# EAGLE design Pinduinov3-Nano-WPC-TPL521-AR (EAGLE 7.7.0)
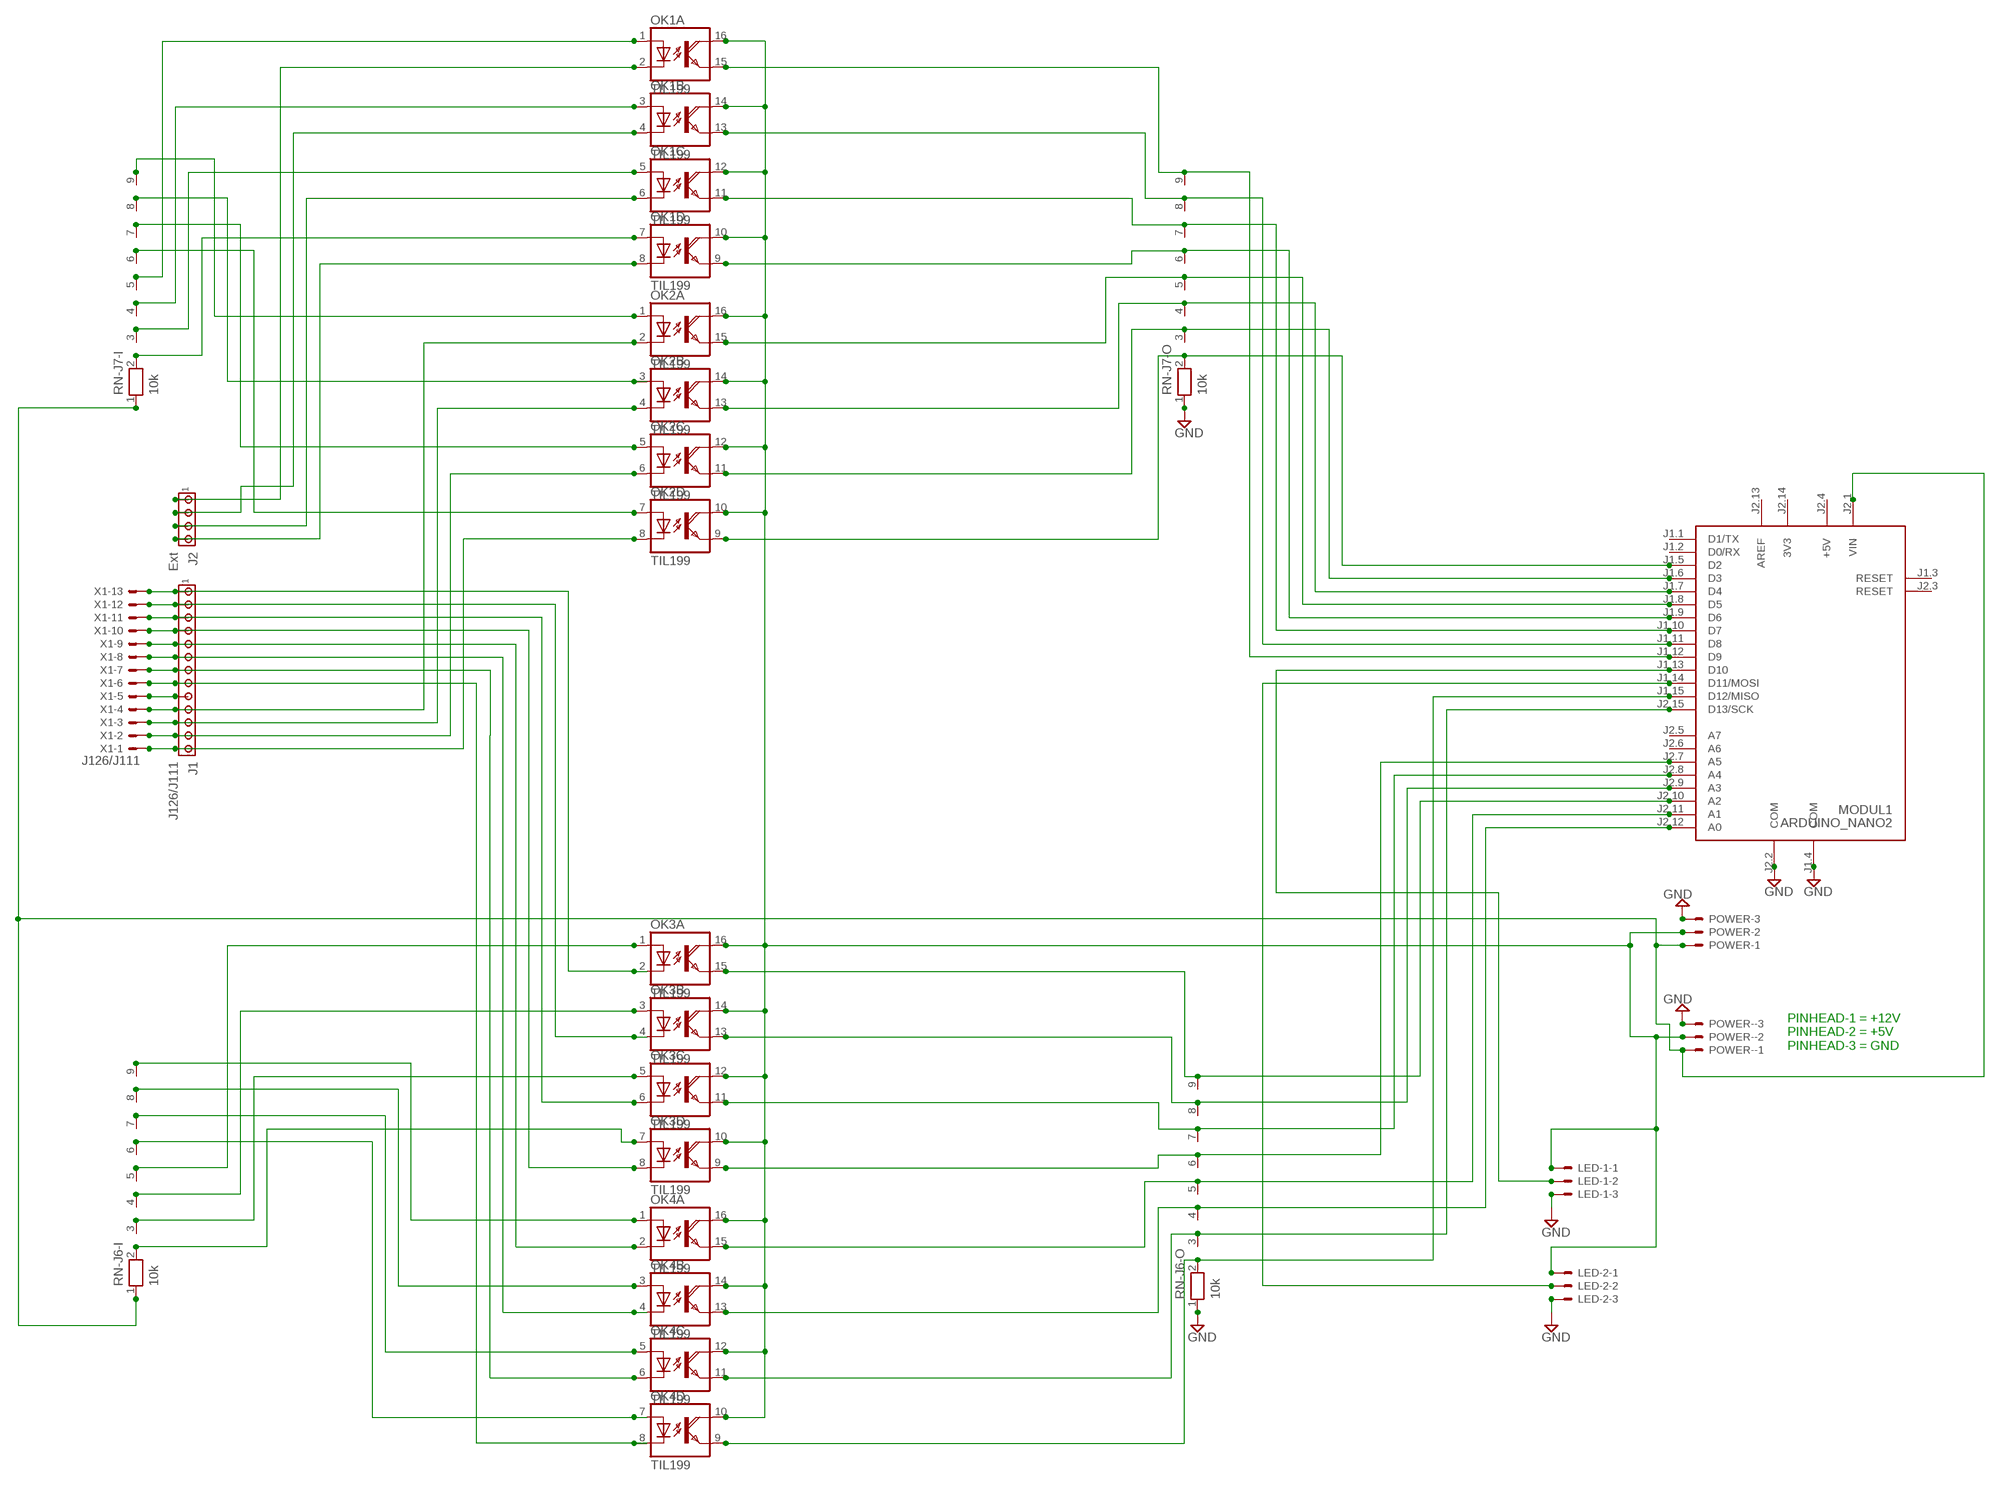
[diagram p0: schematic, sheet 1]

## Parts
J1  J126/J111  MTA13-156  [1X13MTA]
J2  Ext  MTA04-156  [1X4MTA]
LED-1  22-23-2031  [22-23-2031]
LED-2  22-23-2031  [22-23-2031]
MODUL1  ARDUINO_NANO2  [ARDUINO_NANO2]
OK1  TIL199  [DIL16]
OK2  TIL199  [DIL16]
OK3  TIL199  [DIL16]
OK4  TIL199  [DIL16]
POWER  22-23-2031  [22-23-2031]
POWER-  22-23-2031  [22-23-2031]
RN-J6-I  10k  RN08  [RN-9]
RN-J6-O  10k  RN08  [RN-9]
RN-J7-I  10k  RN08  [RN-9]
RN-J7-O  10k  RN08  [RN-9]
X1  J126/J111  KK-156-13  [KK-156-13]

## Nets
ARD+5V [Power]: LED-1.1 LED-2.1 OK1.10(D:COL) OK1.12(C:COL) OK1.14(B:COL) OK1.16(A:COL) OK2.10(D:COL) OK2.12(C:COL) OK2.14(B:COL) OK2.16(A:COL) OK3.10(D:COL) OK3.12(C:COL) OK3.14(B:COL) OK3.16(A:COL) OK4.10(D:COL) OK4.12(C:COL) OK4.14(B:COL) OK4.16(A:COL) POWER-.2 POWER.2
GND: LED-1.3 LED-2.3 MODUL1.J1.4(COM) MODUL1.J2.2(COM) POWER-.3 POWER.3 RN-J6-O.1 RN-J7-O.1
N$2: MODUL1.J1.5(D2) OK2.9(D:EMI) RN-J7-O.2
N$3: OK1.3(B:A) RN-J7-I.4
N$4: OK1.5(C:A) RN-J7-I.3
N$5: OK1.7(D:A) RN-J7-I.2
N$6: OK2.1(A:A) RN-J7-I.9
N$7: OK2.3(B:A) RN-J7-I.8
N$8: OK2.5(C:A) RN-J7-I.7
N$9: OK1.1(A:A) RN-J7-I.5
N$13: OK2.7(D:A) RN-J7-I.6
N$15: J2.1 OK1.2(A:C)
N$18: MODUL1.J1.6(D3) OK2.11(C:EMI) RN-J7-O.3
N$19: J1.11 OK2.4(B:C) X1.3
N$20: J1.12 OK2.6(C:C) X1.2
N$21: J1.2 OK3.4(B:C) X1.12
N$22: J1.1 OK3.2(A:C) X1.13
N$23: J1.10 OK2.2(A:C) X1.4
N$24: MODUL1.J1.11(D8) OK1.13(B:EMI) RN-J7-O.8
N$25: J1.13 OK2.8(D:C) X1.1
N$27: J1.5 OK4.2(A:C) X1.9
N$28: MODUL1.J1.7(D4) OK2.13(B:EMI) RN-J7-O.4
N$29: OK4.1(A:A) RN-J6-I.9
N$30: OK4.3(B:A) RN-J6-I.8
N$31: OK4.5(C:A) RN-J6-I.7
N$32: OK3.3(B:A) RN-J6-I.4
N$33: OK3.1(A:A) RN-J6-I.5
N$34: OK3.5(C:A) RN-J6-I.3
N$35: OK4.7(D:A) RN-J6-I.6
N$36: MODUL1.J2.8(A4) OK3.11(C:EMI) RN-J6-O.7
N$37: OK3.7(D:A) RN-J6-I.2
N$38: MODUL1.J2.7(A5) OK3.9(D:EMI) RN-J6-O.6
N$39: MODUL1.J2.15(D13/SCK) OK4.11(C:EMI) RN-J6-O.3
N$40: J2.2 OK1.4(B:C)
N$42: MODUL1.J2.12(A0) OK4.13(B:EMI) RN-J6-O.4
N$43: MODUL1.J2.11(A1) OK4.15(A:EMI) RN-J6-O.5
N$44: LED-2.2 MODUL1.J1.14(D11/MOSI)
N$45: LED-1.2 MODUL1.J1.13(D10)
N$46: MODUL1.J1.12(D9) OK1.15(A:EMI) RN-J7-O.9
N$47: J2.3 OK1.6(C:C)
N$48: J2.4 OK1.8(D:C)
N$49: MODUL1.J1.10(D7) OK1.11(C:EMI) RN-J7-O.7
N$51: MODUL1.J1.8(D5) OK2.15(A:EMI) RN-J7-O.5
N$54: MODUL1.J1.9(D6) OK1.9(D:EMI) RN-J7-O.6
N$55: MODUL1.J2.9(A3) OK3.13(B:EMI) RN-J6-O.8
N$56: MODUL1.J2.10(A2) OK3.15(A:EMI) RN-J6-O.9
N$58: J1.8 OK4.8(D:C) X1.6
N$59: J1.7 OK4.6(C:C) X1.7
N$60: MODUL1.J1.15(D12/MISO) OK4.9(D:EMI) RN-J6-O.2
N$61 [GND]: MODUL1.J2.1(VIN) POWER-.1 POWER.1 RN-J6-I.1 RN-J7-I.1
N$62: J1.6 OK4.4(B:C) X1.8
N$64: J1.9 X1.5
N$65: J1.4 OK3.8(D:C) X1.10
N$66: J1.3 OK3.6(C:C) X1.11
Unconnected: MODUL1.J1.1(D1/TX) MODUL1.J1.2(D0/RX) MODUL1.J1.3(RESET) MODUL1.J2.3(RESET) MODUL1.J2.5(A7) MODUL1.J2.6(A6)

## Notes on the sheet
- PINHEAD-1 = +12V
  PINHEAD-2 = +5V
  PINHEAD-3 = GND

## Power pins joined to a net without a drawn wire
3V3: MODUL1.J2.14(3V3)
+5V: MODUL1.J2.4(+5V)
AREF: MODUL1.J2.13(AREF)

## Library data of the parts
J1 = con-amp:MTA13-156: AMP connector
J2 = con-amp:MTA04-156: AMP connector
LED-1 LED-2 POWER POWER- = con-molex:22-23-2031: .100" (2.54mm) Center Header - 3 Pin; MF: MOLEX; MPN: 22-23-2031; OC_FARNELL: 1462950; OC_NEWARK: 30C0862
MODUL1 = arduino:ARDUINO_NANO2: Arduino Nano2 Auto generated by modulcreator.ulp \;; ANZAHL: 2; MODUL: TRUE; STECKX0: -76200; STECKX1: 76200; STECKY0: 177800; STECKY1: 177800
OK1-OK4 = optocoupler:TIL199: TEXAS INSTRUMENTS OPTO COUPLER; MPN: TIL 199; OC_FARNELL: 1683370; OC_NEWARK: 05R6483
RN-J6-I RN-J6-O RN-J7-I RN-J7-O = resistor-net:RN08: RESISTOR NETWORK; OC_FARNELL: unknown; OC_NEWARK: unknown
X1 = con-molex:KK-156-13: KK 156 HEADER Source: http://www.molex.com/pdm_docs/sd/026604100_sd.pdf; OC_FARNELL: unknown; OC_NEWARK: unknown

## Net classes
0 default: width 0.406 mm
1 Power: width 0.61 mm
2 GND: width 0.61 mm

## Board
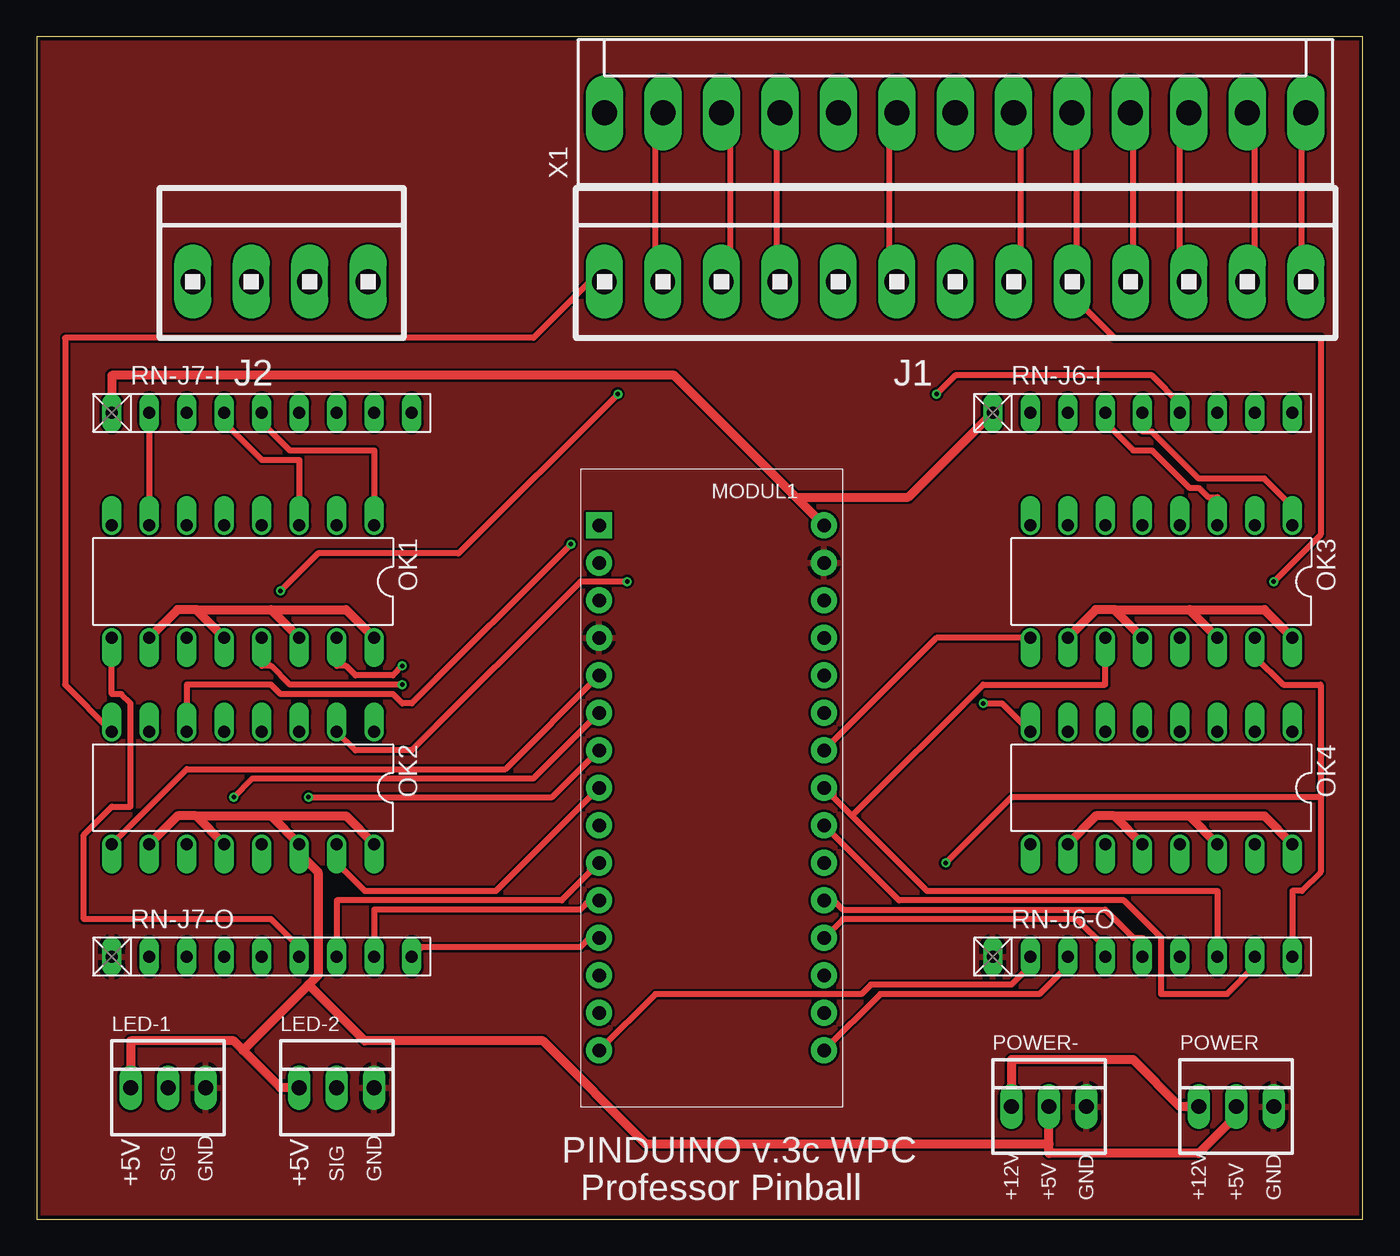
[diagram p1: board, top side]
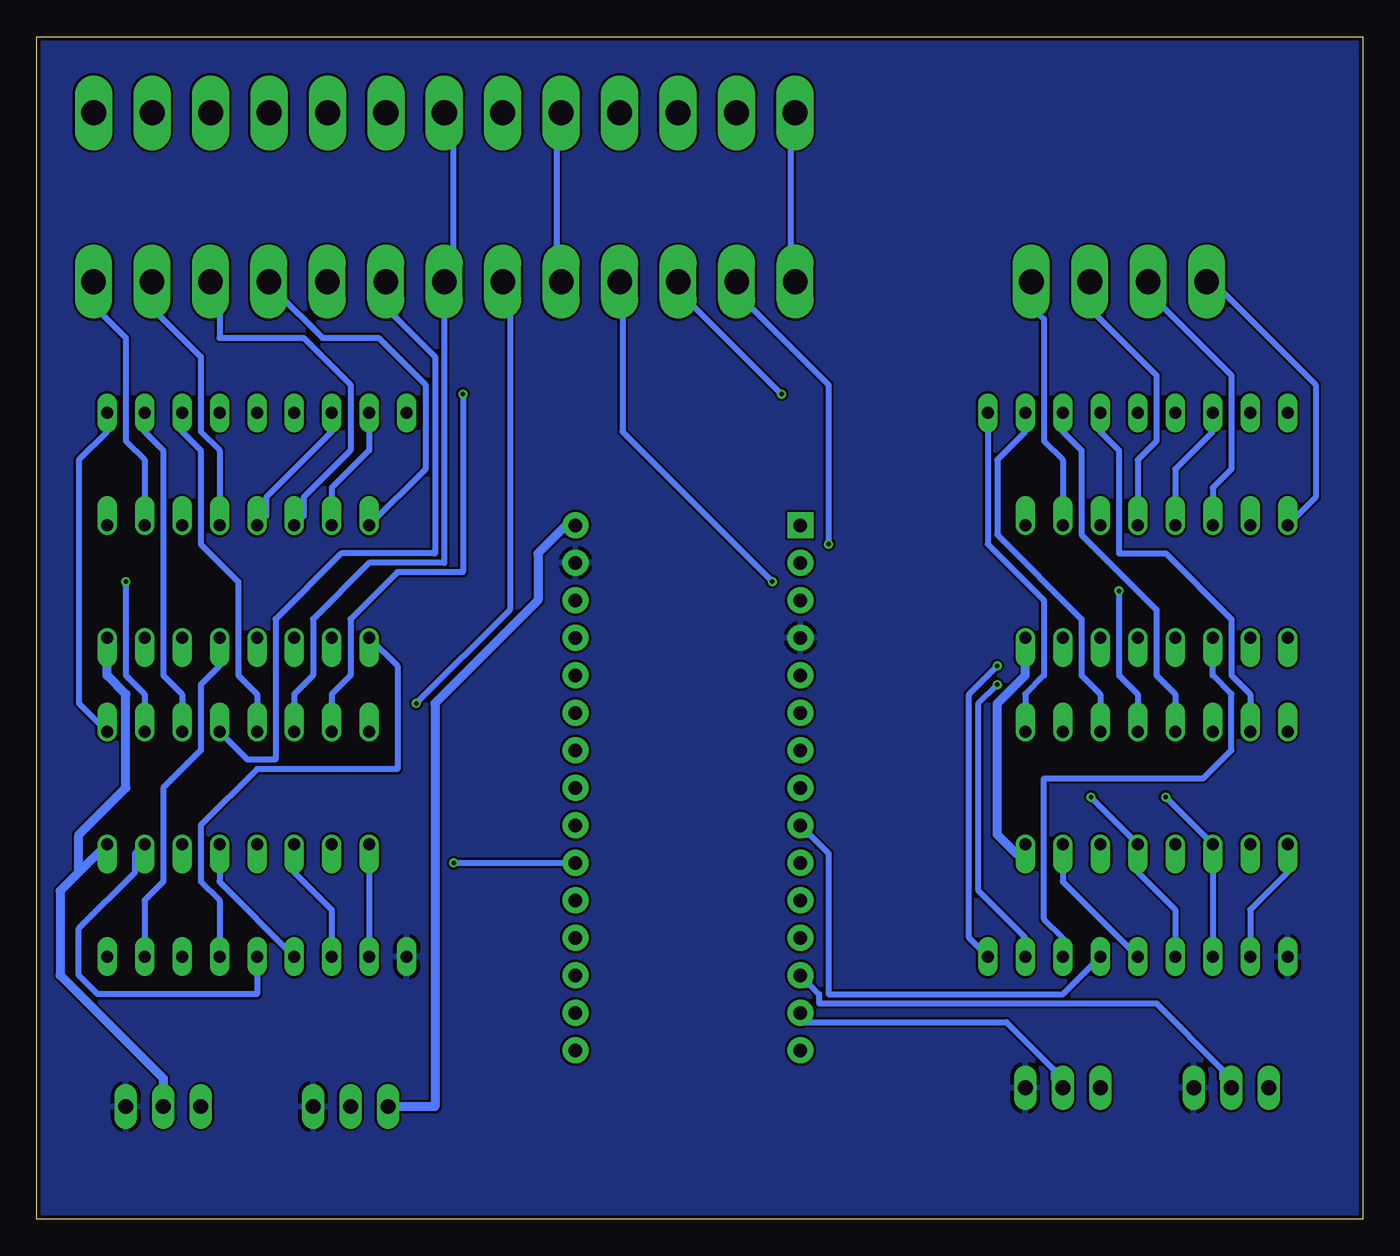
[diagram p2: board, bottom side, seen from below]

Size 89.84 x 80.08 mm. Coordinates in mm from the lower left corner, seen from the top.
Outline: 0,0 89.84,0 89.84,80.08 0,80.08 0,0
Copper layers (1*16): Top 0.035mm / dielectric 1.5mm / Bottom 0.035mm
Design rules "SeeedStudio_2layer_DRU_no_angle_20140221": minimum track width 6mil, minimum drill 12mil, track to track 6mil, track to pad 6mil, pad to pad 6mil, via to via 6mil, smd to smd 0mil, copper to edge 10mil, drill to drill 10mil, minimum pad ring 10mil, minimum via ring 6mil, stop-mask expansion 2mil, vias tented up to drill 100mil, thermal gap 10mil

### Footprints (pad centres in the part's own frame; a part is rotated, then mirrored left to right if it is on the bottom)
1X13MTA = drill 1.676 long: 1 23.774,0; 2 19.812,0; 3 15.85,0; 4 11.887,0; 5 7.925,0; 6 3.962,0; 7 0,0; 8 -3.962,0; 9 -7.925,0; 10 -11.887,0; 11 -15.85,0; 12 -19.812,0; 13 -23.774,0
1X4MTA = drill 1.676 long: 1 5.944,0; 2 1.981,0; 3 -1.981,0; 4 -5.944,0
22-23-2031 = drill 1 long: 1 -2.54,0; 2 0,0; 3 2.54,0
ARDUINO_NANO2 = drill 0.914 pad 1.778 square: J1.1 -7.62,17.78 | drill 0.914 pad 1.778: J1.2 -7.62,15.24; J1.3 -7.62,12.7; J1.4 -7.62,10.16; J1.5 -7.62,7.62; J1.6 -7.62,5.08; J1.7 -7.62,2.54; J1.8 -7.62,0; J1.9 -7.62,-2.54; J1.10 -7.62,-5.08; J1.11 -7.62,-7.62; J1.12 -7.62,-10.16; J1.13 -7.62,-12.7; J1.14 -7.62,-15.24; J1.15 -7.62,-17.78; J2.1 7.62,17.78; J2.2 7.62,15.24; J2.3 7.62,12.7; J2.4 7.62,10.16; J2.5 7.62,7.62; J2.6 7.62,5.08; J2.7 7.62,2.54; J2.8 7.62,0; J2.9 7.62,-2.54; J2.10 7.62,-5.08; J2.11 7.62,-7.62; J2.12 7.62,-10.16; J2.13 7.62,-12.7; J2.14 7.62,-15.24; J2.15 7.62,-17.78
DIL16 = drill 0.813 offset: 1 -8.89,-3.81; 2 -6.35,-3.81; 3 -3.81,-3.81; 4 -1.27,-3.81; 5 1.27,-3.81; 6 3.81,-3.81; 7 6.35,-3.81; 8 8.89,-3.81; 9 8.89,3.81; 10 6.35,3.81; 11 3.81,3.81; 12 1.27,3.81; 13 -1.27,3.81; 14 -3.81,3.81; 15 -6.35,3.81; 16 -8.89,3.81
RN-9 = drill 0.813 long: 1 -10.16,0; 2 -7.62,0; 3 -5.08,0; 4 -2.54,0; 5 0,0; 6 2.54,0; 7 5.08,0; 8 7.62,0; 9 10.16,0
KK-156-13 = drill 1.7 pad 2.184 long: 1 -23.76,0; 2 -19.8,0; 3 -15.84,0; 4 -11.88,0; 5 -7.92,0; 6 -3.96,0; 7 0,0; 8 3.96,0; 9 7.92,0; 10 11.88,0; 11 15.84,0; 12 19.8,0; 13 23.76,0

### Placement (x,y rotation side)
J1  62.23,63.5 0 top
J2  16.51,63.5 0 top
LED-1  8.89,8.89 0 top
LED-2  20.32,8.89 0 top
MODUL1  45.72,29.21 0 top
OK1  13.97,43.18 180 top
OK2  13.97,29.21 180 top
OK3  76.2,43.18 180 top
OK4  76.2,29.21 180 top
POWER  81.28,7.62 0 top
POWER-  68.58,7.62 0 top
RN-J6-I  74.93,54.61 0 top
RN-J6-O  74.93,17.78 0 top
RN-J7-I  15.24,54.61 0 top
RN-J7-O  15.24,17.78 0 top
X1  62.23,74.93 0 top

### Tracks (layer width: path | path; a pad name or v marks a point on that pad's centre or on a via)
ARD+5V
  Top 0.61: OK1.10 9.53,41.27 10.79,41.27 | OK1.12 10.79,41.27 | 15.88,41.27 OK1.14 | 10.79,41.27 15.88,41.27 | OK1.16 20.95,41.27 15.88,41.27 | LED-1.1 6.35,12.06 13.34,12.06 13.97,11.43 | 13.97,11.43 16.51,8.89 LED-2.1 | OK2.10 9.53,27.3 10.79,27.3 | OK2.12 10.79,27.3 | 15.88,27.3 OK2.14 17.78,24.77 19.05,23.5 19.05,16.51 18.41,15.88 | 10.79,27.3 15.88,27.3 | OK2.16 20.95,27.3 15.88,27.3 | 18.41,15.88 13.97,11.43 | OK3.10 71.75,41.27 73.03,41.27 | OK3.12 73.03,41.27 | 78.11,41.27 OK3.14 | 73.03,41.27 78.11,41.27 | OK3.16 83.19,41.27 78.11,41.27 | 68.58,5.08 68.58,4.45 78.74,4.45 81.28,6.99 POWER.2 | 68.58,5.08 POWER-.2 | OK4.10 71.75,27.3 73.03,27.3 | OK4.12 73.03,27.3 | 78.11,27.3 OK4.14 | 73.03,27.3 78.11,27.3 | OK4.16 83.19,27.3 78.11,27.3 | 18.41,15.88 22.23,12.06 34.29,12.06 41.27,5.08 68.58,5.08
  Bottom 0.61: OK1.16 22.86,36.83 24.77,34.92 24.77,26.04 23.5,24.77 22.86,24.77 OK2.16 | POWER.2 81.28,9.53 88.27,16.51 88.27,22.23 87,23.5 | OK4.16 87,23.5 | OK3.16 85.09,36.83 83.82,35.56 83.82,29.21 87,26.04 87,23.5
GND
  pour Top: -1.27,81.28 -1.27,-2.54 92.71,-2.54 92.71,81.28
  pour Bottom: -2.54,82.55 -2.54,-1.27 91.44,-1.27 91.44,82.55
N$2
  Top 0.406: MODUL1.J1.5 31.75,30.48 10.16,30.48 OK2.9
  Bottom 0.406: RN-J7-O.2 7.62,20.95 5.08,23.5 OK2.9
N$3
  Top 0.406: OK1.3 17.78,51.44 15.24,51.44 12.7,53.98 RN-J7-I.4
N$4
  Bottom 0.406: OK1.5 12.7,50.8 10.16,53.34 RN-J7-I.3
N$5
  Top 0.406: RN-J7-I.2 OK1.7
N$6
  Bottom 0.406: OK2.1 22.86,35.56 21.59,36.83 21.59,41.91 25.4,45.72 RN-J7-I.9
N$7
  Bottom 0.406: OK2.3 17.78,35.56 19.05,36.83 19.05,40.64 24.77,46.35 24.77,51.44 22.86,53.34 RN-J7-I.8
N$8
  Bottom 0.406: OK2.5 12.7,35.56 13.97,36.83 13.97,41.27 19.05,46.35 19.05,52.07 20.32,53.34 RN-J7-I.7
N$9
  Top 0.406: OK1.1 22.86,52.07 17.14,52.07 15.24,53.98 RN-J7-I.5
N$13
  Bottom 0.406: OK2.7 7.62,35.56 8.89,36.83 8.89,40.64 13.34,45.09 16.51,45.09 16.51,52.07 17.78,53.34 RN-J7-I.6
N$15
  Bottom 0.406: OK1.2 20.32,51.44 21.59,52.7 21.59,60.96 22.23,61.59 22.23,63.5 J2.1
N$18  (via drill 0.3)
  Top 0.406: MODUL1.J1.6 33.66,29.84 14.61,29.84 v13.34,28.57
  Bottom 0.406: RN-J7-O.3 OK2.11 v13.34,28.57
N$19  (via drill 0.3)
  Top 0.406: v16.51,42.55 19.05,45.09 28.57,45.09 v39.37,55.88 | X1.3 46.99,74.93 46.99,63.5 J1.11
  Bottom 0.406: OK2.4 15.24,35.56 16.51,36.83 v16.51,42.55 | v39.37,55.88 46.35,62.87 46.35,63.5 J1.11
N$20  (via drill 0.3)
  Top 0.406: OK2.6 10.16,36.2 15.88,36.2 16.51,35.56 24.13,35.56 24.77,34.92 25.4,34.92 v36.2,45.72 | X1.2 41.91,74.93 41.91,63.5 J1.12
  Bottom 0.406: v36.2,45.72 36.2,56.52 41.91,62.23 41.91,63.5 J1.12
N$21
  Top 0.406: X1.12 82.55,74.93 82.55,63.5 J1.2
  Bottom 0.406: OK3.4 77.47,52.07 78.74,53.34 78.74,58.42 81.92,61.59 81.92,63.5 J1.2
N$22
  Top 0.406: X1.13 85.72,74.93 85.72,63.5 J1.1
  Bottom 0.406: OK3.2 82.55,51.44 83.82,52.7 83.82,59.69 85.72,61.59 85.72,63.5 J1.1
N$23  (via drill 0.3)
  Top 0.406: OK2.2 21.59,31.75 25.4,31.75 36.83,43.18 v40.01,43.18 | X1.4 50.16,74.93 50.16,63.5 J1.10
  Bottom 0.406: v40.01,43.18 50.16,53.34 50.16,63.5 J1.10
N$24  (via drill 0.3)
  Top 0.406: RN-J7-O.8 22.86,20.95 36.83,20.95 37.47,21.59 MODUL1.J1.11 | OK1.13 15.24,37.47 15.88,37.47 17.14,36.2 v24.77,36.2
  Bottom 0.406: v24.77,36.2 26.04,34.92 26.04,22.23 22.86,19.05 RN-J7-O.8
N$25
  Top 0.406: OK2.8 1.91,36.2 1.91,59.69 33.66,59.69 37.47,63.5 J1.13
  Bottom 0.406: X1.1 38.73,74.93 38.73,63.5 J1.13
N$27  (via drill 0.3)
  Top 0.406: v83.82,43.18 87,46.35 87,59.69 73.03,59.69 70.48,62.23 70.48,63.5 | 70.48,63.5 70.48,74.93 X1.9 | 70.48,63.5 J1.5
  Bottom 0.406: OK4.2 82.55,35.56 83.82,36.83 v83.82,43.18
N$28  (via drill 0.3)
  Top 0.406: MODUL1.J1.7 34.92,28.57 v18.41,28.57
  Bottom 0.406: RN-J7-O.4 12.7,20.95 15.24,23.5 OK2.13 v18.41,28.57
N$29
  Bottom 0.406: OK4.1 87,34.92 87,51.44 85.09,53.34 RN-J6-I.9
N$30
  Bottom 0.406: OK4.3 80.01,35.56 81.28,36.83 81.28,52.07 82.55,53.34 RN-J6-I.8
N$31
  Bottom 0.406: OK4.5 74.93,35.56 76.2,36.83 76.2,43.18 78.74,45.72 78.74,52.07 80.01,53.34 RN-J6-I.7
N$32
  Top 0.406: OK3.3 80.01,48.9 79.38,48.9 78.74,49.53 78.11,49.53 75.56,52.07 74.3,52.07 72.39,53.98 RN-J6-I.4
N$33
  Top 0.406: RN-J6-I.5 74.93,53.34 75.56,53.34 78.74,50.16 83.19,50.16 85.09,48.26 OK3.1
N$34
  Bottom 0.406: OK3.5 74.3,47.62 74.3,48.9 69.85,53.34 RN-J6-I.3
N$35  (via drill 0.3)
  Top 0.406: v60.96,55.88 62.23,57.15 75.56,57.15 77.47,55.24 RN-J6-I.6
  Bottom 0.406: OK4.7 69.85,35.56 68.58,36.83 68.58,40.64 65.41,43.81 60.96,43.81 v60.96,55.88
N$36
  Top 0.406: RN-J6-O.7 80.01,22.23 60.33,22.23 55.24,27.3 | 55.24,27.3 53.98,28.57 53.98,29.21 MODUL1.J2.8 | OK3.11 72.39,36.2 64.14,36.2 55.24,27.3
N$37
  Bottom 0.406: OK3.7 69.85,49.53 67.31,52.07 RN-J6-I.2
N$38
  Top 0.406: MODUL1.J2.7 60.96,39.37 OK3.9
  Bottom 0.406: RN-J6-O.6 77.47,21.59 78.74,22.86 78.74,26.67 74.93,30.48 65.41,30.48 65.41,37.47 OK3.9
N$39
  Top 0.406: MODUL1.J2.15 57.15,15.24 67.94,15.24 69.85,17.14 RN-J6-O.3
  Bottom 0.406: RN-J6-O.3 69.85,20.95 72.39,23.5 OK4.11
N$40
  Bottom 0.406: OK1.4 15.24,51.44 13.97,52.7 13.97,57.15 18.41,61.59 18.41,63.5 J2.2
N$42
  Top 0.406: MODUL1.J2.12 54.61,20.32 70.48,20.32 72.39,18.41 RN-J6-O.4
  Bottom 0.406: RN-J6-O.4 77.47,22.86 OK4.13
N$43
  Top 0.406: RN-J6-O.5 74.93,19.05 74.3,19.05 72.39,20.95 54.61,20.95 53.98,21.59 MODUL1.J2.11
  Bottom 0.406: OK4.15 83.19,24.77 83.19,23.5 87,19.68 87,16.51 85.72,15.24 74.93,15.24 RN-J6-O.5
N$44
  Bottom 0.406: LED-2.2 20.95,9.53 20.95,10.16 24.13,13.34 38.1,13.34 MODUL1.J1.14
N$45
  Bottom 0.406: LED-1.2 9.53,9.53 9.53,10.16 13.97,14.61 36.83,14.61 36.83,15.24 37.47,15.88 38.1,15.88 MODUL1.J1.13
N$46  (via drill 0.3)
  Top 0.406: RN-J7-O.9 26.04,18.41 36.83,18.41 37.47,19.05 MODUL1.J1.12 | OK1.15 20.32,37.47 20.95,37.47 21.59,36.83 24.13,36.83 v24.77,37.47
  Bottom 0.406: v24.77,37.47 26.67,35.56 26.67,19.05 RN-J7-O.9
N$47
  Bottom 0.406: OK1.6 10.16,49.53 8.89,50.8 8.89,57.15 13.97,62.23 13.97,63.5 J2.3
N$48
  Bottom 0.406: OK1.8 3.17,48.9 3.17,56.52 10.16,63.5 J2.4
N$49
  Top 0.406: RN-J7-O.7 20.32,21.59 35.56,21.59 37.47,23.5 37.47,24.13 MODUL1.J1.10
  Bottom 0.406: OK1.11 10.16,36.83 8.89,35.56 8.89,31.75 10.79,29.84 21.59,29.84 21.59,20.32 20.32,19.05 RN-J7-O.7
N$51
  Top 0.406: MODUL1.J1.8 31.11,22.23 22.23,22.23 20.32,24.13 OK2.15
  Bottom 0.406: RN-J7-O.5 20.32,22.86 OK2.15
N$54
  Top 0.406: OK1.9 5.08,35.56 5.71,35.56 6.35,34.92 6.35,27.94 5.08,27.94 3.17,26.04 3.17,20.32 15.88,20.32 17.78,18.41 RN-J7-O.6
  Bottom 0.406: RN-J7-O.6 20.32,15.24 36.2,15.24 36.2,24.77 37.47,26.04 38.1,26.04 MODUL1.J1.9
N$55
  Top 0.406: MODUL1.J2.9 58.42,21.59 73.66,21.59 76.2,19.05 76.2,15.24 80.64,15.24 82.55,17.14 RN-J6-O.8
  Bottom 0.406: RN-J6-O.8 82.55,21.59 81.28,22.86 81.28,29.21 78.74,31.75 78.74,36.2 77.47,37.47 OK3.13
N$56  (via drill 0.3)
  Top 0.406: RN-J6-O.9 85.09,22.23 85.72,22.23 87,23.5 87,28.57 | 87,28.57 87,36.2 84.45,36.2 82.55,38.1 OK3.15 | v61.59,24.13 66.04,28.57 87,28.57
  Bottom 0.406: v61.59,24.13 MODUL1.J2.10
N$58  (via drill 0.3)
  Top 0.406: OK4.8 65.41,34.92 v64.14,34.92 | X1.6 57.78,74.93 57.78,63.5 J1.8
  Bottom 0.406: v64.14,34.92 57.78,41.27 57.78,63.5 J1.8
N$59
  Bottom 0.406: OK4.6 72.39,35.56 71.12,36.83 71.12,40.64 67.31,44.45 62.23,44.45 J1.7 61.59,64.14 61.59,74.3 X1.7
N$60
  Top 0.406: MODUL1.J1.15 41.91,15.24 55.88,15.24 56.52,15.88 66.04,15.88 67.31,17.14 RN-J6-O.2
  Bottom 0.406: OK4.9 RN-J6-O.2
N$61
  Top 0.61: POWER-.1 66.04,10.79 74.3,10.79 77.47,7.62 POWER.1 | RN-J7-I.1 5.08,57.15 43.18,57.15 51.44,48.9 | MODUL1.J2.1 51.44,48.9 | RN-J6-I.1 59.05,48.9 51.44,48.9
  Bottom 0.61: POWER-.1 62.87,7.62 62.87,34.92 55.88,41.91 55.88,45.09 53.98,46.99 MODUL1.J2.1
N$62
  Top 0.406: X1.8 66.67,74.93 66.67,63.5 J1.6
  Bottom 0.406: OK4.4 75.56,31.11 73.66,31.11 73.66,40.64 69.22,45.09 62.87,45.09 62.87,58.42 66.04,61.59 66.04,63.5 J1.6
N$64
  Bottom 0.406: J1.9 54.61,63.5 54.61,74.93 X1.5
N$65
  Top 0.406: X1.10 74.3,74.93 74.3,63.5 J1.4
  Bottom 0.406: OK3.8 63.5,50.8 63.5,56.52 66.67,59.69 70.48,59.69 73.66,62.87 73.66,63.5 J1.4
N$66
  Top 0.406: X1.11 77.47,74.93 77.47,63.5 J1.3
  Bottom 0.406: OK3.6 71.75,47.62 71.75,48.9 68.58,52.07 68.58,56.52 71.75,59.69 77.47,59.69 77.47,63.5 J1.3

### Text on the board
tNames: +5V | +5V | PINDUINO v.3c WPC | SIG | GND | SIG | GND | +5V | +5V | Professor Pinball | +12V | GND | +12V | GND